# EAGLE design OpenLux-v1a (EAGLE 6.4)
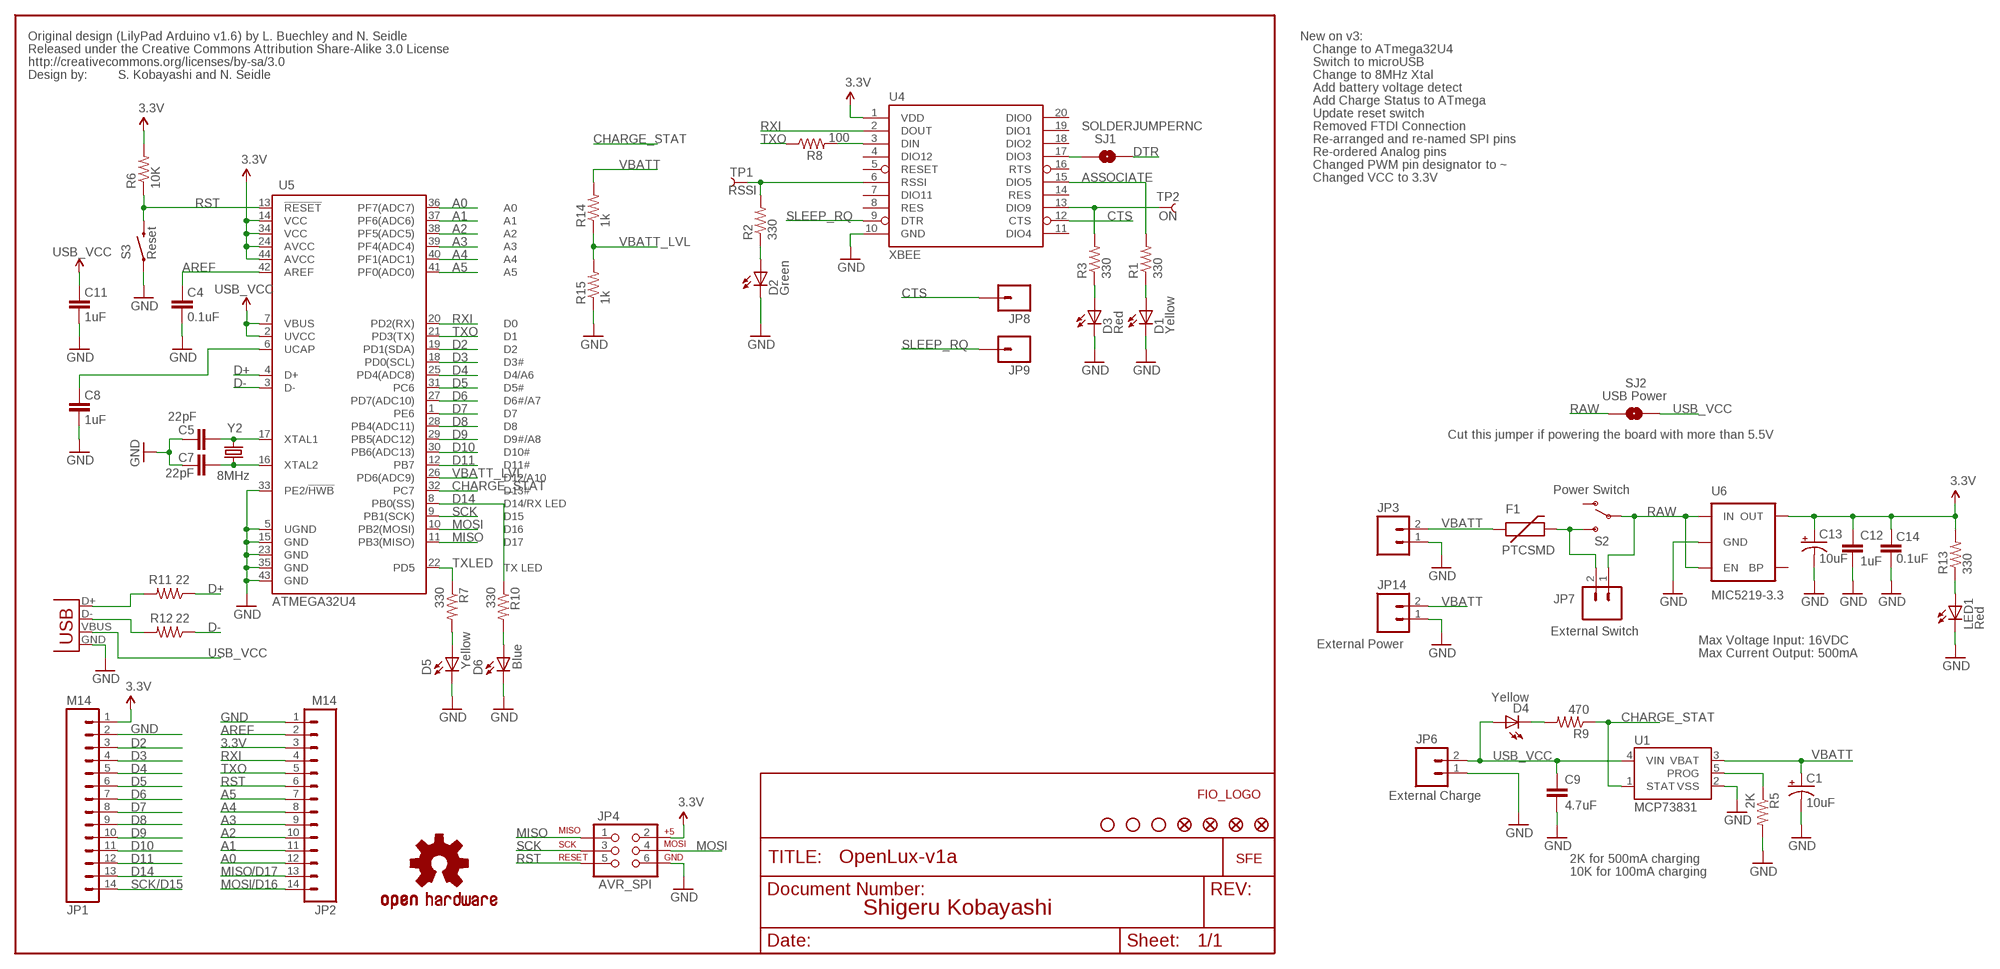
[diagram p0: schematic, sheet 1]

## Parts
C1  10uF  CAP_POL1206  [EIA3216]
C4  0.1uF  CAP0402-CAP  [0402-CAP]
C5  22pF  CAP0402-CAP  [0402-CAP]
C7  22pF  CAP0402-CAP  [0402-CAP]
C8  1uF  CAP0402-CAP  [0402-CAP]
C9  4.7uF  CAP0402-CAP  [0402-CAP]
C11  1uF  CAP0402-CAP  [0402-CAP]
C12  1uF  CAP0402-CAP  [0402-CAP]
C13  10uF  CAP_POL1206  [EIA3216]
C14  0.1uF  CAP0402-CAP  [0402-CAP]
D1  Yellow  LED0603  [LED-0603]
D2  Green  LED0603  [LED-0603]
D3  Red  LED0603  [LED-0603]
D4  Yellow  LED0603  [LED-0603]
D5  Yellow  LED0603  [LED-0603]
D6  Blue  LED0603  [LED-0603]
F1  PTCSMD  [PTC-1206]
JP1  M14  [1X14]
JP2  M14  [1X14]
JP3  M02-JST-2MM-SMT  [JST-2-SMD]
JP4  AVR_SPI  AVR_SPI_PRG_6PTH  [2X3]
JP5  STAND-OFF  [STAND-OFF]
JP6  External Charge  M02PTH  [1X02]
JP7  External Switch  M02PTH  [1X02]
JP8  M01PTH  [1X01]
JP9  M01PTH  [1X01]
JP10  FIDUCIALUFIDUCIAL  FIDUCIAL1X2  [FIDUCIAL-1X2]
JP11  FIDUCIALUFIDUCIAL  FIDUCIAL1X2  [FIDUCIAL-1X2]
JP12  FIDUCIALUFIDUCIAL  FIDUCIAL1X2  [FIDUCIAL-1X2]
JP13  FIDUCIALUFIDUCIAL  FIDUCIAL1X2  [FIDUCIAL-1X2]
JP14  External Power  M02PTH  [1X02]
JP16  STAND-OFF  [STAND-OFF]
JP17  STAND-OFF  [STAND-OFF]
LED1  Red  LED0603  [LED-0603]
R1  330  RESISTOR0402-RES  [0402-RES]
R2  330  RESISTOR0402-RES  [0402-RES]
R3  330  RESISTOR0402-RES  [0402-RES]
R5  2K  RESISTOR0402-RES  [0402-RES]
R6  10K  RESISTOR0402-RES  [0402-RES]
R7  330  RESISTOR0402-RES  [0402-RES]
R8  100  RESISTOR0402-RES  [0402-RES]
R9  470  RESISTOR0402-RES  [0402-RES]
R10  330  RESISTOR0402-RES  [0402-RES]
R11  22  RESISTOR0402-RES  [0402-RES]
R12  22  RESISTOR0402-RES  [0402-RES]
R13  330  RESISTOR0402-RES  [0402-RES]
R14  1k  RESISTOR0402-RES  [0402-RES]
R15  1k  RESISTOR0402-RES  [0402-RES]
S2  Power Switch  SWITCH-SPSTSMD  [AYZ0202]
S3  Reset  SWITCH-MOMENTARY-2SMD  [TACTILE_SWITCH_SMD]
SJ1  SOLDERJUMPERNC  [SJ_2S]
SJ2  USB Power  SOLDERJUMPERTRACE  [SJ_2S-TRACE]
TP1  RSSI  TEST-POINT3X5  [PAD.03X.05]
TP2  ON  TEST-POINT3X5  [PAD.03X.05]
U1  MCP73831  [SOT23-5]
U4  XBEE  XBEE-1B3  [XBEE-SMD]
U5  ATMEGA32U4  ATMEGA32U4QFN2  [QFN-44-NOPAD]
U6  MIC5219-3.3  V_REG_LDOSMD  [SOT23-5]
U$1  LOGO-SFENEW  [SFE-NEW-WEBLOGO]
U$2  OSHW-LOGOS  [OSHW-LOGO-S]
U$3  CREATIVE_COMMONS  [CREATIVE_COMMONS]
U$6  FIO_LOGOV2  [FUNNEL_LOGO_BOTTOM_V2]
X2  USB-MICROB  [USB-MICROB]
Y2  8MHz  CRYSTAL5X3  [CRYSTAL-SMD-5X3]

## Nets
3.3V [vcc]: C12.1 C13.A(+) C14.2 JP1.1 JP2.3 JP4.2 R6.2 R13.2 U4.1(VDD) U5.14(VCC) U5.24(AVCC) U5.34(VCC) U5.44(AVCC) U6.5(OUT)
A0: JP2.12 U5.36(PF7(ADC7))
A1: JP2.11 U5.37(PF6(ADC6))
A2: JP2.10 U5.38(PF5(ADC5))
A3: JP2.9 U5.39(PF4(ADC4))
A4: JP2.8 U5.40(PF1(ADC1))
A5: JP2.7 U5.41(PF0(ADC0))
AREF: C4.2 JP2.2 U5.42(AREF)
ASSOCIATE: R1.2 U4.15(DIO5)
CHARGE_STAT: R9.1 U1.1(STAT) U5.32(PC7)
CTS: JP8.1 U4.12(CTS)
D2: JP1.3 U5.19(PD1(SDA))
D3: JP1.4 U5.18(PD0(SCL))
D4: JP1.5 U5.25(PD4(ADC8))
D5: JP1.6 U5.31(PC6)
D6: JP1.7 U5.27(PD7(ADC10))
D7: JP1.8 U5.1(PE6)
D8: JP1.9 U5.28(PB4(ADC11))
D9: JP1.10 U5.29(PB5(ADC12))
D10: JP1.11 U5.30(PB6(ADC13))
D11: JP1.12 U5.12(PB7)
D14: JP1.13 R10.1 U5.8(PB0(SS))
D+: R11.1 U5.4(D+)
D-: R12.1 U5.3(D-)
DTR: SJ1.2
GND: C1.C(-) C4.1 C5.2 C7.2 C8.1 C9.2 C11.1 C12.2 C13.C(-) C14.1 D1.C D2.C D3.C D5.C D6.C JP1.2 JP2.1 JP3.1 JP4.6 JP6.1 JP14.1 LED1.C R5.2 R15.1 S3.1 U1.2(VSS) U4.10(GND) U5.5(UGND) U5.15(GND) U5.23(GND) U5.33(PE2/!HWB) U5.35(GND) U5.43(GND) U6.2(GND) X2.GND
MISO: JP2.13 JP4.1 U5.11(PB3(MISO))
MOSI: JP2.14 JP4.4 U5.10(PB2(MOSI))
N$1: R3.2 TP2.P$1 U4.13(DIO9)
N$2: D1.A R1.1
N$3: D2.A R2.1
N$4: R2.2 TP1.P$1 U4.6(RSSI)
N$6: D3.A R3.1
N$7: R8.2 U4.3(DIN)
N$8: D4.C R9.2
N$9: F1.2 JP7.2 S2.3(S)
N$11: R5.1 U1.5(PROG)
N$13: SJ1.1 U4.17(DIO3)
N$15: D5.A R7.2
N$16: C7.1 U5.16(XTAL2) Y2.1
N$17: C5.1 U5.17(XTAL1) Y2.3
N$19: D6.A R10.2
N$20: R12.2 X2.D-
N$21: R11.2 X2.D+
N$38: LED1.A R13.1
RAW [vcc]: JP7.1 S2.2(P) SJ2.1 U6.1(IN) U6.3(EN)
RST: JP2.6 JP4.5 R6.1 S3.3 U5.13(!RESET)
RXI: JP2.4 U4.2(DOUT) U5.20(PD2(RX))
SCK: JP1.14 JP4.3 U5.9(PB1(SCK))
SLEEP_RQ: JP9.1 U4.9(DTR)
TXLED: R7.1 U5.22(PD5)
TXO: JP2.5 R8.1 U5.21(PD3(TX))
UCAP: C8.2 U5.6(UCAP)
USB_VCC: C9.1 C11.2 D4.A JP6.2 SJ2.2 U1.4(VIN) U5.2(UVCC) U5.7(VBUS) X2.VBUS
VBATT: C1.A(+) F1.1 JP3.2 JP14.2 R14.2 U1.3(VBAT)
VBATT_LVL: R14.1 R15.2 U5.26(PD6(ADC9))
Unconnected: S2.1(O) U4.4(DIO12) U4.5(RESET) U4.7(DIO11) U4.8(RES) U4.11(DIO4) U4.14(RES) U4.16(RTS) U4.18(DIO2) U4.19(DIO1) U4.20(DIO0) U6.4(BP)

## Notes on the sheet
- Original design (LilyPad Arduino v1.6) by L. Buechley and N. Seidle | New on v3:
- Change to ATmega32U4
- Switch to microUSB
- S. Kobayashi and N. Seidle | Change to 8MHz Xtal
- Add battery voltage detect
- Add Charge Status to ATmega
- Update reset switch
- Removed FTDI Connection
- Re-arranged and re-named SPI pins
- Re-ordered Analog pins
- Changed PWM pin designator to ~
- Changed VCC to 3.3V
- Cut this jumper if powering the board with more than 5.5V
- Max Voltage Input: 16VDC
- Max Current Output: 500mA
- 2K for 500mA charging
- /D17 | 10K for 100mA charging
- /D15 | /D16
- Shigeru Kobayashi

## Library data of the parts
C1 C13 = SparkFun:CAP_POL: Capacitor Polarized These are standard SMD and PTH capacitors. Normally 10uF, 47uF, and 100uF in electrolytic and tantalum varieties. Always verify the external diameter of the through hole cap, it varies with capacity, voltage, and manufacturer. The EIA devices should be standard.
C4 C5 C7-C9 C11 C12 C14 = SparkFun:CAP: Capacitor Standard 0603 ceramic capacitor, and 0.1" leaded capacitor.
D1-D6 LED1 = SparkFun:LED: LEDs Standard schematic elements and footprints for 5mm, 3mm, 1206, and 0603 sized LEDs. 5mm - Spark Fun Electronics SKU : COM-00529 (and others)
F1 = SparkFun:PTC: Resettable Fuse PTC Resettable Fuse. Spark Fun Electronics SKU : COM-08357
JP1 JP2 = SparkFun:M14: Header 14 Standard 14-pin 0.1" header. Use with straight break away headers (SKU : PRT-00116), right angle break away headers (PRT-00553), swiss pins (PRT-00743), machine pins (PRT-00117), and female headers (PRT-00115).
JP3 JP6 JP7 JP14 = SparkFun:M02: Header 2 Standard 2-pin 0.1" header. Use with straight break away headers (SKU : PRT-00116), right angle break away headers (PRT-00553), swiss pins (PRT-00743), machine pins (PRT-00117), and female headers (PRT-00115). Molex polarized connector foot print use with SKU : PRT-08233 with associated crimp pins and housings.
JP4 = SparkFun:AVR_SPI_PRG_6: AVR ISP 6 Pin This is the reduced ISP connector for AVR programming. Common on Arduino. This footprint will take up less PCB space and can be used with a 10-pin to 6-pin adapter such as SKU: BOB-08508
JP5 JP16 JP17 = SparkFun:STAND-OFF: Stand Off This is the mechanical footprint for a #4 phillips button head screw. Use the keepout ring to avoid running the screw head into surrounding components. SKU : PRT-00447
JP8 JP9 = SparkFun:M01: Header 1 Standard 1-pin 0.1" header. Use with straight break away headers (SKU : PRT-00116), right angle break away headers (PRT-00553), swiss pins (PRT-00743), machine pins (PRT-00117), and female headers (PRT-00115).
JP10-JP13 = SparkFun:FIDUCIAL: Fiducial Alignment Points Various fiducial points for machine vision alignment.
R1-R3 R5-R15 = SparkFun:RESISTOR: Resistor Basic schematic elements and footprints for 0603, 1206, and PTH resistors.
S2 = SparkFun:SWITCH-SPST: SPST Switch Simple slide switch. Spark Fun Electronics SKU : COM-00102
S3 = SparkFun:SWITCH-MOMENTARY-2
SJ1 SJ2 = SparkFun:SOLDERJUMPER: Solder Jumper Standard SMD solder jumper. Used to automate production. Two varients : Normally Open and Normally Closed are the same, but have different paste layers. NC will have a large amount of paste and should jumper during reflow.
TP1 TP2 = SparkFun:TEST-POINT
U1 = SparkFun:MCP73831: Microchip's MCP73831 Miniature single cell, fully integrated Li-Ion, Li-polymer charge management controller http://ww1.microchip.com/downloads/en/DeviceDoc/21984a.pdf
U4 = SparkFun:XBEE-1
U5 = QFN44:ATMEGA32U4
U6 = SparkFun:V_REG_LDO: Voltage Regulator LDO Standard 150mA LDO voltage regulator in SOT-23 layout. Micrel part MIC5205. BP (by-pass) pin is used to lower output noise with 470pF cap.
U$1 = SparkFun:LOGO-SFE: Spark Fun Electronics PCB Logo This is the standard Spark Fun Electronics PCB logo.
U$2 = SparkFun:OSHW-LOGO: Open Source Hardware Logo This logo indicates the piece of hardware it is found on incorporates a OSHW license and/or adheres to the definition of open source hardware found here: http://freedomdefined.org/OSHW
U$3 = SparkFun:CREATIVE_COMMONS
U$6 = SparkFun:FIO_LOGO
X2 = SparkFun:USB: USB Connectors USB-B-PTH is fully proven SKU : PRT-00139 USB-miniB is fully proven SKU : PRT-00587 USB-A-PCB is untested. USB-A-H is throughly reviewed, but untested. Spark Fun Electronics SKU : PRT-00437 USB-B-SMT is throughly reviewed, but untested. Needs silkscreen touching up. USB-A-S has not been used/tested USB-MB-H has not been used/tested
Y2 = SparkFun:CRYSTAL: Crystals Various standard crystals. Proven footprints. Spark Fun Electronics SKU : COM-00534

## Net classes
0 Default: width 0.203 mm
2 LEDPower: width 0.203 mm
3 ButtonSignal: width 0.203 mm

## Board
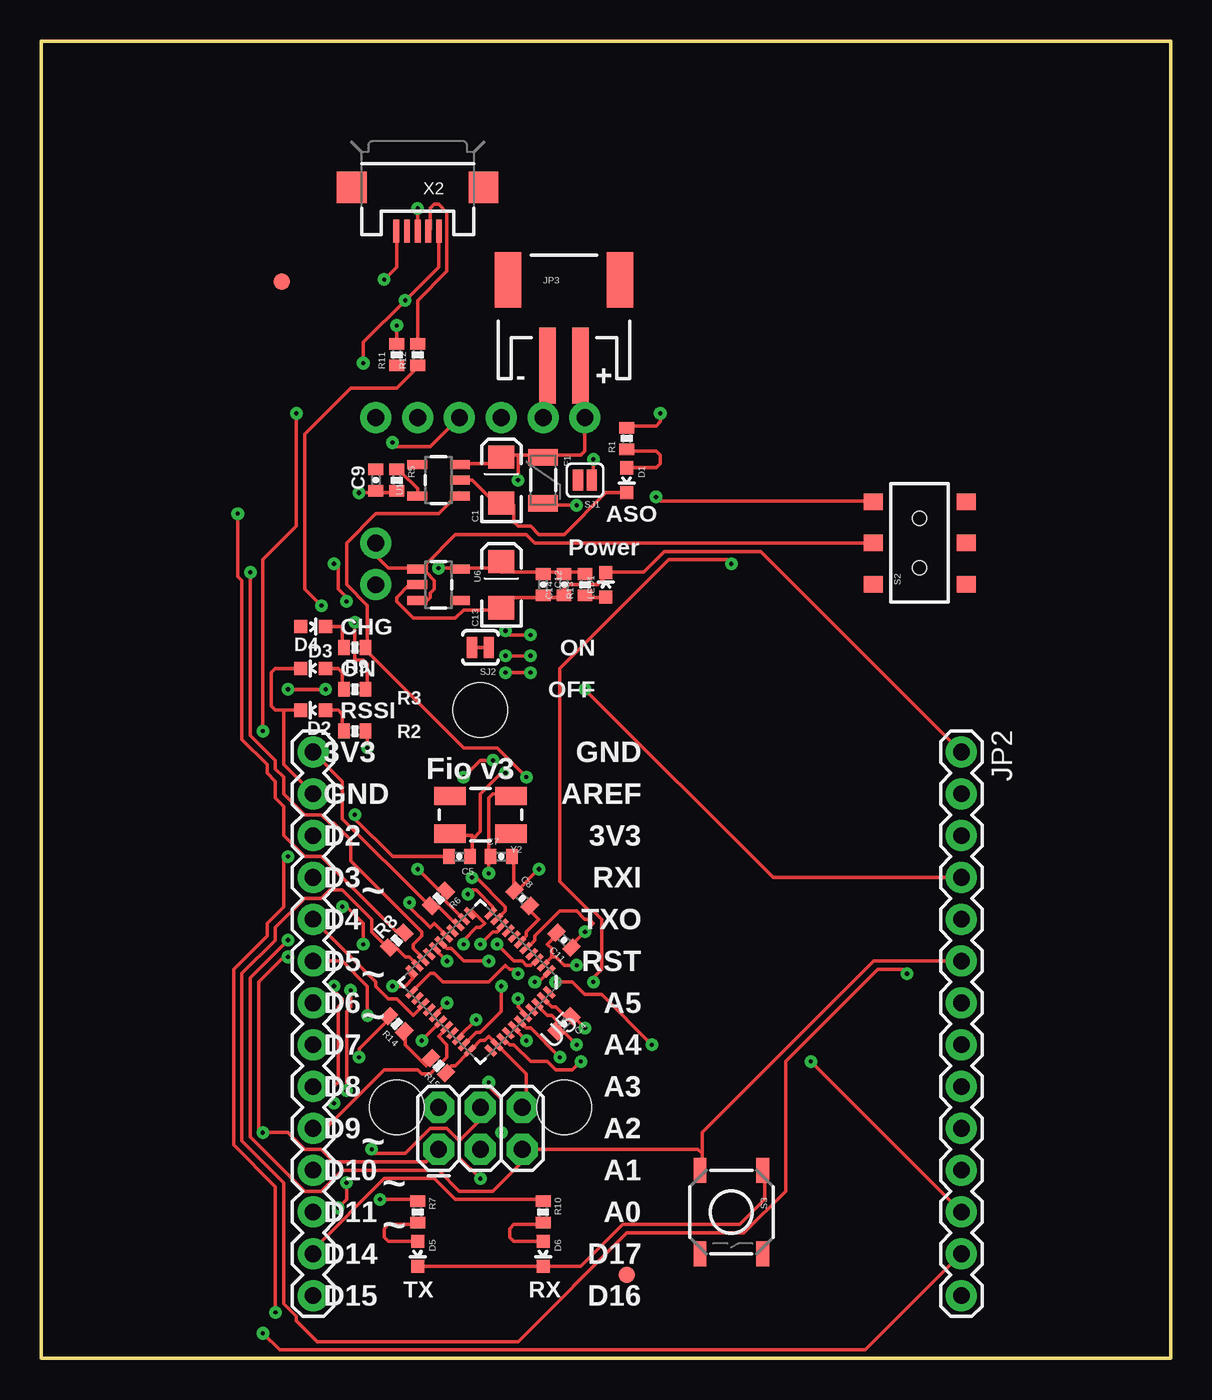
[diagram p1: board, top side]
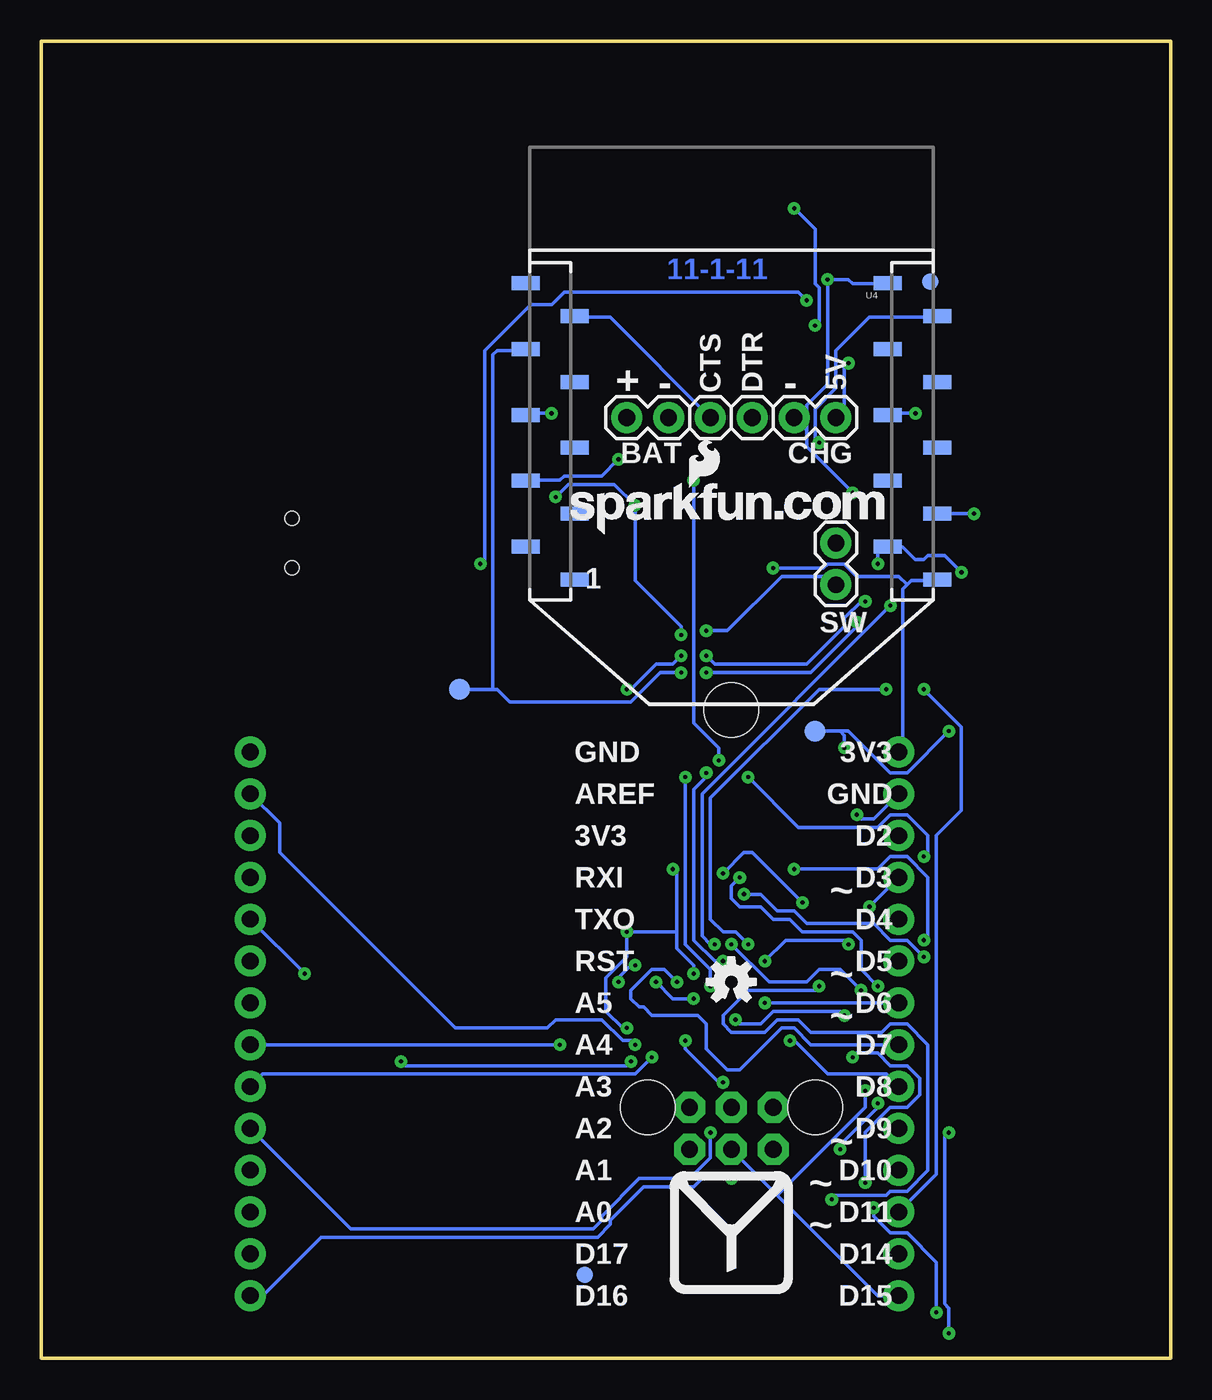
[diagram p2: board, bottom side, seen from below]

Size 68.58 x 80.01 mm. Coordinates in mm from the lower left corner, seen from the top.
Outline: 68.58,80.01 68.58,0 0,0 0,80.01 68.58,80.01
Copper layers (1*16): Top 0.035mm / dielectric 1.5mm / Bottom 0.035mm
Design rules "SparkFun *": minimum track width 8mil, minimum drill 10mil, track to track 7mil, track to pad 7mil, pad to pad 7mil, via to via 7mil, smd to smd 7mil, copper to edge 10mil, drill to drill 8mil, minimum pad ring 12mil, minimum via ring 10mil, stop-mask expansion 4mil, vias tented up to drill 20mil, thermal gap 10mil

### Footprints (pad centres in the part's own frame; a part is rotated, then mirrored left to right if it is on the bottom)
EIA3216 = smd 1.4 x 1.6: A 1.4,0; C -1.4,0
0402-CAP = smd 0.7 x 0.9: 1 -0.65,0; 2 0.65,0
LED-0603 = smd 0.8 x 0.8: A 0,-0.75; C 0,0.75
PTC-1206 = smd 1 x 1.8: 1 -1.4,0; 2 1.4,0
1X14 = drill 1.016 pad 1.88: 1 0,0; 2 2.54,0; 3 5.08,0; 4 7.62,0; 5 10.16,0; 6 12.7,0; 7 15.24,0; 8 17.78,0; 9 20.32,0; 10 22.86,0; 11 25.4,0; 12 27.94,0; 13 30.48,0; 14 33.02,0
JST-2-SMD = smd 1 x 4.6: 1 -1,-3.7; 2 1,-3.7 | smd 1.6 x 3.4: NC1 -3.4,1.5; NC2 3.4,1.5
2X3 = drill 1.016 pad 1.88 octagon: 1 0,0; 2 0,2.54; 3 2.54,0; 4 2.54,2.54; 5 5.08,0; 6 5.08,2.54
STAND-OFF = hole 3.302: 0,0
1X02 = drill 1.016 pad 1.88: 1 0,0; 2 2.54,0
1X01 = drill 1.016 pad 1.88: 1 0,0
FIDUCIAL-1X2 = smd 1 x 1: 1 0,0
0402-RES = smd 0.7 x 0.9: 1 -0.65,0; 2 0.65,0
AYZ0202 = smd 1 x 1.15: 1 -2.5,2.825; 2 0,2.825; 3 2.5,2.825; 4 -2.5,-2.825; 5 0,-2.825; 6 2.5,-2.825 | hole 0.85: 1.5,0; -1.5,0
TACTILE_SWITCH_SMD = smd 1.524 x 0.762: 1 -2.54,1.905; 2 2.54,1.905; 3 -2.54,-1.905; 4 2.54,-1.905
SJ_2S = smd 0.635 x 1.27: 1 -0.412,0; 2 0.412,0
SJ_2S-TRACE = smd 0.635 x 1.27: 1 -0.508,0; 2 0.508,0
PAD.03X.05 = smd 1.27 x 1.27: P$1 0,0
SOT23-5 = smd 0.55 x 1.2: 1 -0.95,-1.3; 2 0,-1.3; 3 0.95,-1.3; 4 0.95,1.3; 5 -0.95,1.3
XBEE-SMD = smd 1.7 x 0.85: 1 -12.5,20; 2 -9.5,18; 3 -12.5,16; 4 -9.5,14; 5 -12.5,12; 6 -9.5,10; 7 -12.5,8; 8 -9.5,6; 9 -12.5,4; 10 -9.5,2; 11 12.5,2; 12 9.5,4; 13 12.5,6; 14 9.5,8; 15 12.5,10; 16 9.5,12; 17 12.5,14; 18 9.5,16; 19 12.5,18; 20 9.5,20
QFN-44-NOPAD = smd 0.8 x 0.3: 1 -3.4,2.5; 2 -3.4,2; 3 -3.4,1.5; 4 -3.4,1; 5 -3.4,0.5; 6 -3.4,0; 7 -3.4,-0.5; 8 -3.4,-1; 9 -3.4,-1.5; 10 -3.4,-2; 11 -3.4,-2.5; 23 3.4,-2.5; 24 3.4,-2; 25 3.4,-1.5; 26 3.4,-1; 27 3.4,-0.5; 28 3.4,0; 29 3.4,0.5; 30 3.4,1; 31 3.4,1.5; 32 3.4,2; 33 3.4,2.5 | smd 0.3 x 0.8: 12 -2.5,-3.4; 13 -2,-3.4; 14 -1.5,-3.4; 15 -1,-3.4; 16 -0.5,-3.4; 17 0,-3.4; 18 0.5,-3.4; 19 1,-3.4; 20 1.5,-3.4; 21 2,-3.4; 22 2.5,-3.4; 34 2.5,3.4; 35 2,3.4; 36 1.5,3.4; 37 1,3.4; 38 0.5,3.4; 39 0,3.4; 40 -0.5,3.4; 41 -1,3.4; 42 -1.5,3.4; 43 -2,3.4; 44 -2.5,3.4
USB-MICROB = smd 0.35 x 1.4: D+ 0,2.65; D- -0.65,2.65; GND 1.3,2.65; ID 0.65,2.65; VBUS -1.3,2.65 | smd 1.8 x 1.9: MT1 -4,0; MT2 4,0
CRYSTAL-SMD-5X3 = smd 1.9 x 1.1: 1 -1.85,-1.15; 2 1.85,-1.15; 3 1.85,1.15; 4 -1.85,1.15

### Placement (x,y rotation side)
C1  27.94,53.34 90 top
C4  31.75,20.32 225 top
C5  25.4,30.48 180 top
C7  27.94,30.48 0 top
C8  29.21,27.94 315 top
C9  20.32,53.34 270 top
C11  31.75,25.4 135 top
C12  30.48,46.99 270 top
C13  27.94,46.99 90 top
C14  31.75,46.99 90 top
D1  35.56,53.34 180 top
D2  16.51,39.37 90 top
D3  16.51,41.91 90 top
D4  16.51,44.45 270 top
D5  22.86,6.35 180 top
D6  30.48,6.35 180 top
F1  30.48,53.34 270 top
JP1  16.51,36.83 270 top
JP2  55.88,36.83 270 top
JP3  31.75,64.01 0 top
JP4  24.13,12.7 0 top
JP5  21.59,15.24 0 top
JP6  22.86,57.15 0 bottom
JP7  20.32,49.53 270 bottom
JP8  27.94,57.15 0 bottom
JP9  25.4,57.15 0 bottom
JP10  35.56,5.08 0 top
JP11  14.61,65.41 0 top
JP12  14.61,65.41 0 bottom
JP13  35.56,5.08 0 bottom
JP14  30.48,57.15 180 bottom
JP16  26.67,39.37 0 top
JP17  31.75,15.24 0 top
LED1  34.29,46.99 0 top
R1  35.56,55.88 90 top
R2  19.05,38.1 0 top
R3  19.05,40.64 0 top
R5  21.59,53.34 270 top
R6  24.13,27.94 225 top
R7  22.86,8.89 270 top
R8  21.59,25.4 45 top
R9  19.05,43.18 180 top
R10  30.48,8.89 270 top
R11  21.59,60.96 90 top
R12  22.86,60.96 90 top
R13  33.02,46.99 90 top
R14  21.59,20.32 135 top
R15  24.13,17.78 135 top
S2  53.34,49.53 90 top
S3  41.91,8.89 270 top
SJ1  33.02,53.34 180 top
SJ2  26.67,43.18 180 top
TP1  21.59,38.1 0 bottom
TP2  43.18,40.64 0 bottom
U1  24.13,53.34 90 top
U4  26.67,67.31 180 bottom
U5  26.67,22.86 225 top
U6  24.13,46.99 270 top
U$1  36.45,50.04 0 bottom
U$2  26.67,22.86 0 bottom
U$3  1.27,-6.35 0 top  (outside the outline)
U$6  26.67,7.62 0 top
X2  22.86,71.12 180 top
Y2  26.67,33.02 180 top

### Tracks (layer width: path | path; a pad name or v marks a point on that pad's centre or on a via)
3.3V  (via drill 0.25)
  Top 0.203: 31.75,47.75 30.48,47.75 | 31.75,47.75 33.02,47.75 R13.2 | 31.75,47.75 C14.2 | 27.69,48.01 25.65,48.01 U6.5 25.4,48.01 v24.13,48.01 | 27.69,48.01 27.94,48.26 C13.A 27.69,48.01 | 30.48,47.75 27.94,47.75 27.69,48.01 | 30.48,47.75 C12.1 | U5.14 25.15,26.42 23.88,27.69 R6.2 23.62,27.69 23.37,27.69 18.29,32.77 18.29,35.05 JP1.1
  Bottom 0.203: 16,46.99 16.26,46.74 16.26,37.08 JP1.1 | 16,46.99 15.75,47.24 14.22,47.24 U4.1 | v24.13,48.01 21.08,48.01 20.83,48.26 19.81,48.26 19.05,47.5 16.51,47.5 16,46.99
A0  (via drill 0.25)
  Top 0.203: v32.77,18.03 32.26,17.53 31.24,17.53 30.73,18.03 29.72,18.03 28.7,19.05 28.45,19.05 28.19,19.3 U5.36 | JP2.12 v46.74,18.03
  Bottom 0.203: v32.77,18.03 33.02,17.78 46.48,17.78 v46.74,18.03
A2  (via drill 0.25)
  Top 0.203: v29.46,19.3 28.7,20.07 U5.38 | v27.18,16.76 27.18,16.51 27.94,15.75 v27.94,13.72
  Bottom 0.203: v29.46,19.3 29.46,18.8 27.43,16.76 v27.18,16.76 | v27.94,13.72 27.94,12.19 29.21,10.92 32.26,10.92 34.54,8.64 34.54,8.38 35.05,7.87 49.78,7.87 JP2.10
A3  (via drill 0.25)
  Top 0.203: v31.5,18.29 29.72,20.07 29.46,20.07 29.21,20.32 U5.39
  Bottom 0.203: v31.5,18.29 32.51,17.27 55.12,17.27 JP2.9
A4  (via drill 0.25)
  Top 0.203: v37.08,19.05 34.04,22.1 33.02,22.1 32.26,22.86 v31.24,22.86 | v28.96,21.84 28.96,21.34 29.46,20.83 U5.40
  Bottom 0.203: v37.08,19.05 JP2.8 | v31.24,22.86 30.23,21.84 v28.96,21.84
AREF  (via drill 0.25)
  Top 0.203: 31.5,20.07 v32.51,19.05 | 31.5,20.07 31.5,20.32 30.99,20.83 30.73,20.83 30.23,21.34 U5.42 | 31.5,20.07 C4.2
  Bottom 0.203: JP2.2 54.1,32.51 54.1,30.73 43.43,20.07 37.85,20.07 37.34,20.57 34.54,20.57 33.27,19.3 32.77,19.3 v32.51,19.05
ASSOCIATE  (via drill 0.25)
  Top 0.203: v37.59,57.4 37.59,56.9 37.34,56.64 35.56,56.64 R1.2
  Bottom 0.203: v37.59,57.4 39.12,57.4 U4.15
CHARGE_STAT  (via drill 0.25)
  Top 0.203: U1.1 25.4,52.58 24.13,51.31 20.32,51.31 18.54,49.53 18.54,46.99 19.81,45.72 19.81,43.18 R9.1 19.56,43.18 25.65,37.08 27.69,37.08 v29.46,35.31 | v27.94,22.61 27.94,21.08 26.67,19.81 26.42,19.81 25.65,19.05 U5.32
  Bottom 0.203: v27.94,22.61 27.94,23.62 29.46,25.15 v29.46,35.31
CTS
  Bottom 0.203: JP8.1 34.04,63.25 36.07,63.25 U4.12
D3  (via drill 0.25)
  Top 0.203: v18.29,27.43 18.54,27.43 19.56,26.42 v19.56,25.15 | v24.64,24.13 23.88,24.89 U5.18
  Bottom 0.203: v18.29,27.43 JP1.4 | v19.56,25.15 19.81,25.4 23.37,25.4 v24.64,24.13
D4
  Top 0.203: JP1.5 20.32,22.86 20.32,22.61 21.08,21.84 21.59,21.84 22.61,20.83 23.11,21.34 U5.25
D5  (via drill 0.25)
  Top 0.203: JP1.6 18.29,24.13 19.81,22.61 v19.81,20.83 | v26.42,20.57 25.4,19.56 U5.31
  Bottom 0.203: v19.81,20.83 20.07,21.08 24.13,21.08 24.89,20.32 26.16,20.32 v26.42,20.57
D6  (via drill 0.25)
  Top 0.203: v24.64,21.59 23.88,20.83 U5.27
  Bottom 0.203: JP1.7 v24.64,21.59
D7  (via drill 0.25)
  Top 0.203: v29.97,22.86 30.23,22.86 30.73,23.37 U5.1
  Bottom 0.203: JP1.8 21.84,19.05 22.86,20.07 23.62,20.07 26.16,17.53 26.92,17.53 28.19,18.8 28.19,20.32 28.7,20.83 31.5,20.83 32,21.34 32.26,21.34 32.77,21.84 32.77,22.35 31.5,23.62 30.73,23.62 v29.97,22.86
D8  (via drill 0.25)
  Top 0.203: U5.28 v23.11,19.3
  Bottom 0.203: JP1.9 17.27,17.27 20.83,17.27 22.86,19.3 v23.11,19.3
D9
  Top 0.203: JP1.10 17.27,13.97 20.83,17.53 22.86,17.53 23.11,17.27 23.62,17.27 24.64,18.29 24.64,19.05 24.13,19.56 24.64,20.07 U5.29
D11  (via drill 0.25)
  Top 0.203: v17.27,40.64 v14.99,40.64 | v25.65,25.15 25.65,25.4 26.42,26.16 26.67,26.16 26.92,26.42 26.16,27.18 25.91,27.18 U5.12
  Bottom 0.203: JP1.12 14.22,11.18 14.22,31.75 12.7,33.27 12.7,38.35 v14.99,40.64 | v17.27,40.64 21.34,40.64 27.94,34.04 27.94,26.67 27.18,25.91 26.42,25.91 v25.65,25.15
D14
  Top 0.203: JP1.13 16.51,6.6 20.83,10.92 23.88,10.92 25.15,9.65 30.48,9.65 R10.1
D-  (via drill 0.25)
  Top 0.203: v17.02,45.72 16,46.74 16,56.13 18.8,58.93 21.59,58.93 22.86,60.2 R12.1 | v27.69,25.15 28.7,24.13 29.21,24.13 29.46,23.88 29.72,23.88 29.97,24.13 U5.3
  Bottom 0.203: v17.02,45.72 28.45,34.29 28.45,25.65 27.94,25.15 v27.69,25.15
GND  (via drill 0.25)
  Top 0.203: R15.1 24.64,17.53 24.89,17.78 25.15,17.78 25.91,18.54 U5.33 26.16,18.8 26.67,19.3 26.92,19.3 27.18,19.56 27.69,19.05 | 27.69,19.05 29.46,17.27 29.46,15.49 JP4.6 | 27.69,19.05 U5.35 | v20.83,65.53 21.59,66.29 21.59,68.33 X2.GND | 20.32,52.58 v19.3,52.58 | 20.32,52.58 21.59,52.58 R5.2 | 20.32,52.58 C9.2 | 14.73,39.37 14.22,39.37 13.97,39.62 13.97,41.66 14.22,41.91 D3.C | 14.73,39.37 D2.C | C5.2 21.34,30.48 19.05,32.77 v19.05,33.02 | 14.73,39.37 14.73,36.07 JP1.2 | 27.94,51.82 28.7,51.82 28.7,50.8 28.96,50.55 29.72,50.55 30.23,50.04 31.75,50.04 34.29,52.58 35.56,52.58 D1.C | U1.2 26.16,53.34 27.69,51.82 27.94,51.82 | 27.94,51.82 C1.C | U5.43 30.48,21.84 30.99,21.34 31.24,21.34 32,20.57 C4.1 32.26,20.57 32.51,20.57 v33.02,20.07 | U5.5 29.46,24.89 29.97,25.4 29.97,25.65 31.5,27.18 32.51,27.18 33.02,26.67 33.27,26.67 33.53,26.42 v33.02,25.91 32.26,25.15 C11.1 | v28.96,23.37 28.7,23.62 28.45,23.62 28.19,23.88 27.18,22.86 24.38,22.86 23.88,23.37 23.62,23.37 22.61,22.35 U5.23 | v30.23,29.72 28.96,28.45 C8.1 28.7,28.45 28.7,30.48 C7.2 | 30.48,5.59 22.86,5.59 D5.C | 30.48,5.59 32.77,5.59 35.31,8.13 42.42,8.13 43.94,9.65 43.94,11.43 S3.1 | 30.48,5.59 D6.C | JP14.1 30.48,57.91 30.73,58.17 30.73,60.2 JP3.1 | 31.24,46.23 32,46.99 33.78,46.99 34.29,47.5 LED1.C 34.29,47.75 36.58,47.75 37.85,49.02 43.69,49.02 JP2.1 | 30.48,46.23 31.24,46.23 | 31.24,46.23 31.75,46.23 C14.1 | U6.2 22.35,46.99 21.59,46.23 21.59,45.97 22.61,44.96 25.15,44.96 25.65,45.47 27.94,45.47 | 30.48,46.23 28.7,46.23 28.19,45.72 28.19,45.47 27.94,45.47 | 30.48,46.23 C12.2 | 27.94,45.47 C13.C
  Bottom 0.203: U4.10 17.27,65.28 19.3,65.28 19.56,65.53 v20.83,65.53 20.83,59.18 22.1,57.91 22.1,56.39 | 22.1,56.39 JP6.1 | 22.1,56.39 22.1,55.37 v19.3,52.58 | v19.05,33.02 18.8,32.77 18.03,32.77 JP1.2 | v33.02,20.07 33.27,20.07 34.29,21.08 34.29,23.11 33.02,24.38 v33.02,25.91 29.97,25.91 | v28.96,23.37 28.96,23.88 29.97,24.89 29.97,25.91 | 29.97,25.91 29.97,29.46 v30.23,29.72
MISO  (via drill 0.25)
  Top 0.203: JP4.1 23.37,11.94 17.78,11.94 17.02,12.7 16,12.7 14.99,13.72 v13.46,13.72 13.21,13.72 13.21,22.86 14.73,24.38 v14.99,24.38 | v13.46,1.52 14.48,0.51 50.04,0.51 JP2.13 | v25.91,28.19 26.16,28.45 26.42,28.45 27.43,27.43 27.43,27.18 U5.11
  Bottom 0.203: v13.46,13.72 13.72,13.46 13.72,3.3 13.46,3.05 v13.46,1.52 | v25.91,28.19 24.89,28.19 23.88,27.18 22.86,27.18 22.1,26.42 18.03,26.42 17.02,25.4 16,25.4 v14.99,24.38
MOSI  (via drill 0.25)
  Top 0.203: JP4.4 26.67,14.48 25.4,13.21 | 25.4,13.21 25.4,12.19 v26.67,10.92 | v26.16,29.21 26.42,29.21 28.19,27.43 28.19,27.18 27.69,26.67 U5.10 | v17.78,22.61 17.78,22.35 18.29,21.84 18.29,21.59 18.03,21.34 18.03,16.76 17.78,16.51 v17.78,15.49 | v20.07,12.7 20.32,12.45 22.1,12.45 23.62,13.97 24.64,13.97 25.4,13.21
  Bottom 0.203: v26.67,10.92 28.45,10.92 28.96,10.41 32,10.41 34.04,8.38 34.04,8.13 34.8,7.37 51.56,7.37 55.12,3.81 JP2.14 | v26.16,29.21 26.67,28.7 26.67,27.94 26.16,27.43 24.89,27.43 24.13,26.67 23.11,26.67 22.35,25.91 19.3,25.91 18.8,25.4 18.8,23.62 v17.78,22.61 | v17.78,15.49 17.78,15.24 20.07,12.95 v20.07,12.7
N$1  (via drill 0.25)
  Top 0.203: v19.05,44.7 19.05,42.42 19.56,42.42 19.81,42.16 19.81,40.64 R3.2 | v29.72,41.66 v28.19,41.66
  Bottom 0.203: v19.05,44.7 19.05,44.45 21.84,41.66 v28.19,41.66 | v29.72,41.66 30.99,41.66 32.77,39.88 40.13,39.88 40.89,40.64 41.15,40.64 | TP2.P$1 41.15,40.64 | 41.15,40.64 41.15,60.96 40.89,61.21 39.37,61.21 U4.13
N$2
  Top 0.203: D1.A 35.56,54.1 37.34,54.1 37.59,54.36 37.59,54.86 37.34,55.12 35.56,55.12 R1.1
N$3
  Top 0.203: D2.A 18.03,39.37 18.29,39.12 18.29,38.1 R2.1
N$4  (via drill 0.25)
  Top 0.203: v19.81,37.08 19.81,38.1 R2.2 | v15.49,57.4 15.49,50.55 13.46,48.51 v13.46,38.1
  Bottom 0.203: v19.81,37.08 19.81,37.85 20.07,38.1 | TP1.P$1 20.07,38.1 | v15.49,57.4 17.02,57.4 U4.6 | v13.46,38.1 16,35.56 17.02,35.56 19.56,38.1 20.07,38.1
N$6
  Top 0.203: D3.A 18.03,41.91 18.29,41.66 18.29,40.64 R3.1
N$7  (via drill 0.25)
  Top 0.203: v11.94,51.31 11.94,47.5 12.19,47.24 12.19,37.59 13.72,36.07 13.72,35.56 14.22,35.05 14.22,34.04 14.73,33.53 14.73,31.75 16,30.48 17.02,30.48 21.59,25.91 21.84,25.91 R8.2
  Bottom 0.203: v11.94,51.31 13.97,51.31 U4.3
N$8
  Top 0.203: D4.C 18.29,44.45 18.29,43.18 R9.2
N$9  (via drill 0.25)
  Top 0.203: v37.34,52.32 37.59,52.07 50.29,52.07 S2.3 | v32.51,51.82 30.48,51.82 F1.2 | v28.19,44.2 28.45,43.94 v29.72,43.94
  Bottom 0.203: v37.34,52.32 36.58,53.09 33.78,53.09 v32.51,51.82 32.51,47.24 29.72,44.45 v29.72,43.94 | JP7.2 20.83,47.5 23.62,47.5 26.92,44.2 v28.19,44.2
N$11
  Top 0.203: R5.1 21.59,53.85 21.84,53.85 22.86,52.83 22.86,52.58 U1.5
N$13  (via drill 0.25)
  Top 0.203: v33.53,54.61 33.53,53.34 SJ1.1
  Bottom 0.203: v33.53,54.61 34.54,53.59 36.83,53.59 37.08,53.34 39.12,53.34 U4.17
N$15
  Top 0.203: D5.A 22.86,7.11 21.08,7.11 20.83,7.37 20.83,7.87 21.08,8.13 22.86,8.13 R7.2
N$16  (via drill 0.25)
  Top 0.203: 27.18,30.48 27.18,34.04 27.43,34.29 28.45,34.29 Y2.1 | v22.35,27.69 22.35,27.43 23.62,26.16 23.88,26.42 24.64,25.65 U5.16 | 27.18,30.48 v27.18,29.46 | 27.18,30.48 C7.1
  Bottom 0.203: v22.35,27.69 25.4,30.73 25.91,30.73 v27.18,29.46
N$17  (via drill 0.25)
  Top 0.203: 26.16,31.5 26.16,31.75 24.89,31.75 Y2.3 | 26.16,31.5 26.16,30.48 C5.1 | v27.18,24.13 25.65,24.13 24.89,24.89 24.64,24.89 24.38,25.15 U5.17 | v28.19,35.56 27.94,35.56 26.67,34.29 26.67,32 26.16,31.5
  Bottom 0.203: v27.18,24.13 27.69,24.13 28.96,25.4 28.96,34.54 28.19,35.31 v28.19,35.56
N$19
  Top 0.203: D6.A 30.48,7.11 28.7,7.11 28.45,7.37 28.45,7.87 28.7,8.13 30.48,8.13 R10.2
N$20
  Top 0.203: R12.2 22.86,64.26 24.64,66.04 24.64,69.6 24.13,70.1 23.88,70.1 23.62,69.85 23.62,68.58 X2.D-
N$21  (via drill 0.25)
  Top 0.203: v21.59,62.74 R11.2 | X2.D+ v22.86,69.85
  Bottom 0.203: v21.59,62.74 21.34,62.99 21.34,65.02 21.59,65.28 21.59,68.58 v22.86,69.85
N$38
  Top 0.203: LED1.A 34.29,46.23 33.02,46.23 R13.1
RAW
  Top 0.203: S2.2 29.97,49.53 29.46,50.04 25.15,50.04 23.37,48.26 | 23.37,48.26 22.86,47.75 U6.1 22.61,48.01 21.08,48.01 20.32,48.77 JP7.1 | 23.37,48.26 23.37,47.75 23.88,47.24 23.88,46.74 23.62,46.48 23.62,46.23 23.37,45.97 22.86,45.97 U6.3
RST  (via drill 0.25)
  Top 0.203: U5.13 25.65,26.67 24.38,27.94 24.38,28.19 R6.1 24.38,28.45 24.13,28.45 v22.86,29.72 | 40.13,12.45 39.88,12.7 JP4.5 29.21,11.94 27.43,10.16 25.4,10.16 24.13,11.43 18.29,11.43 17.02,10.16 16,10.16 12.7,13.46 12.7,23.11 v14.99,25.4 | 40.13,12.45 40.13,11.43 S3.3 | JP2.6 50.55,24.13 40.13,13.72 40.13,12.45
  Bottom 0.203: v22.86,29.72 17.78,29.72 17.02,30.48 16,30.48 14.73,29.21 14.73,25.65 v14.99,25.4
RXI  (via drill 0.25)
  Top 0.203: v12.7,47.75 12.7,37.85 14.22,36.32 14.22,35.81 14.73,35.31 14.73,34.29 16,33.02 17.02,33.02 17.53,32.51 17.78,32.51 18.8,31.5 18.8,30.23 23.11,25.91 23.11,25.65 22.61,25.15 22.61,24.89 23.11,24.38 U5.20 | JP2.4 44.45,29.21 v33.02,40.64 | v28.19,42.67 v29.72,42.67 | v18.54,45.97 18.54,46.23 18.03,46.74 18.03,48.01 v17.78,48.26
  Bottom 0.203: v12.7,47.75 13.72,48.77 14.73,48.77 14.99,48.51 15.49,48.51 16.26,49.28 17.02,49.28 U4.2 17.27,49.28 17.78,49.28 v17.78,48.26 | v33.02,40.64 32.77,40.64 31.24,42.16 30.23,42.16 v29.72,42.67 | v28.19,42.67 27.69,42.16 22.1,42.16 19.81,44.45 19.81,44.96 18.8,45.97 v18.54,45.97
SCK  (via drill 0.25)
  Top 0.203: v26.67,25.15 27.43,25.91 27.69,25.91 27.94,26.16 U5.9 | v18.8,22.35 18.8,21.34 18.54,21.08 v18.54,16.26
  Bottom 0.203: 23.88,9.91 17.78,3.81 JP1.14 | 23.88,9.91 JP4.3 | v26.67,25.15 24.38,22.86 22.1,22.86 21.34,23.62 20.07,23.62 v18.8,22.35 | v18.54,16.26 18.54,15.24 23.88,9.91
SLEEP_RQ  (via drill 0.25)
  Top 0.203: v21.34,55.63 21.59,55.37 23.62,55.37 JP9.1
  Bottom 0.203: v21.34,55.63 21.59,55.88 21.59,57.66 20.32,58.93 20.32,61.21 18.29,63.25 14.22,63.25 U4.9
TXLED  (via drill 0.25)
  Top 0.203: v20.57,9.65 22.86,9.65 R7.1 | v21.34,22.61 22.1,22.61 22.61,23.11 22.35,23.37 22.35,23.62 U5.22
  Bottom 0.203: v20.57,9.65 20.32,9.91 17.27,9.91 17.02,10.16 16,10.16 14.73,11.43 14.73,19.05 16,20.32 17.02,20.32 17.53,19.81 21.84,19.81 22.61,20.57 23.88,20.57 24.64,19.81 26.67,19.81 27.18,20.32 27.18,20.83 25.65,22.35 21.59,22.35 v21.34,22.61
TXO  (via drill 0.25)
  Top 0.203: U5.21 22.86,23.88 22.35,24.38 22.1,24.38 21.34,25.15 R8.1 21.08,25.15 20.83,25.15 20.07,25.91 20.07,26.67 18.29,28.45 17.53,28.45 17.02,27.94 16,27.94 14.22,26.16 14.22,25.4 12.19,23.37 12.19,13.21 14.73,10.67 14.73,3.3 15.49,2.54 15.49,2.29 16.76,1.02 28.96,1.02 35.56,7.62 42.67,7.62 45.21,10.16 45.21,18.03 50.8,23.62 52.32,23.62 v52.58,23.37
  Bottom 0.203: JP2.5 v52.58,23.37
UCAP
  Top 0.203: U5.6 29.46,25.65 29.46,25.91 30.23,26.67 29.46,27.43 C8.2
USB_VCC  (via drill 0.25)
  Top 0.203: 30.99,24.38 30.48,23.88 U5.2 | 30.99,24.38 30.99,24.89 30.73,25.15 31.24,25.65 C11.2 | v19.56,60.45 19.56,61.72 v22.1,64.26 24.13,66.29 24.13,68.33 X2.VBUS | 30.99,24.38 31.24,24.38 31.75,23.88 v32.51,23.88 | v33.53,22.86 33.53,23.11 34.04,23.62 34.04,26.67 33.53,27.18 33.27,27.18 31.5,28.96 31.5,41.91 38.1,48.51 41.66,48.51 v41.91,48.26
  Bottom 0.203: v19.56,60.45 19.81,60.2 19.81,57.66 JP6.2 | v32.51,23.88 32.77,23.88 33.53,23.11 v33.53,22.86 | v41.91,48.26 41.66,48.51 41.66,61.21 38.86,64.01 37.59,64.01 36.83,64.77 22.61,64.77 v22.1,64.26
VBATT  (via drill 0.25)
  Top 0.203: JP3.2 32.77,60.2 32.77,58.17 33.02,57.91 JP14.2 33.02,55.12 32.77,54.86 30.48,54.86 | v19.3,18.29 19.3,18.8 21.08,20.57 R14.2 | v18.54,10.67 18.54,9.65 v18.03,9.14 | v14.22,2.79 14.22,10.41 11.68,12.95 11.68,23.62 13.72,25.65 13.72,26.42 14.73,27.43 14.73,30.23 v14.99,30.48 | v25.65,35.31 26.67,36.32 v27.43,36.32 | 28.96,54.86 v28.96,53.34 | 28.96,54.86 27.94,54.86 C1.A 27.94,54.61 27.69,54.36 25.65,54.36 U1.3 | 28.96,54.86 30.48,54.86 | 30.48,54.86 F1.1
  Bottom 0.203: v19.3,18.29 19.05,18.54 17.78,18.54 17.02,17.78 16,17.78 15.24,17.02 15.24,16 16,15.24 17.02,15.24 18.54,13.72 v18.54,10.67 | v18.03,9.14 18.03,8.64 17.02,7.62 16,7.62 14.22,5.84 v14.22,2.79 | v14.99,30.48 14.73,30.73 14.73,31.75 16,33.02 17.02,33.02 17.78,32.26 22.61,32.26 v25.65,35.31 | v27.43,36.32 27.43,37.08 28.96,38.61 v28.96,53.34
VBATT_LVL
  Top 0.203: R14.1 22.1,19.81 22.1,19.05 23.37,17.78 23.62,18.03 R15.2

### Text on the board
Bottom: 11-1-11
tPlace: - | + | ASO | Power | CHG | ON | ON | OFF | RSSI | GND | 3V3 | Fio v3 | AREF | GND | 3V3 | D2 | RXI | D3 | ~ | TXO | D4 | RST | D5 | ~ | A5 | D6 | ~ | A4 | D7 | A3 | D8 | A2 | D9 | ~ | A1 | D10 | ~ | A0 | D11 | ~ | D17 | D14 | D16 | D15 | TX | RX | S. Kobayashi and N. Seidle
bPlace: 5V | - | DTR | CTS | - | + | CHG | BAT | 1 | SW | 3V3 | GND | GND | AREF | D2 | 3V3 | D3 | RXI | D4 | ~ | TXO | D5 | RST | D6 | ~ | A5 | D7 | ~ | A4 | D8 | A3 | D9 | A2 | D10 | ~ | A1 | D11 | ~ | A0 | ~ | D14 | D17 | D15 | D16